# Altium schematic sheet [03] SM 1223 DI16_DQ16 x relay.SchDoc
size A4
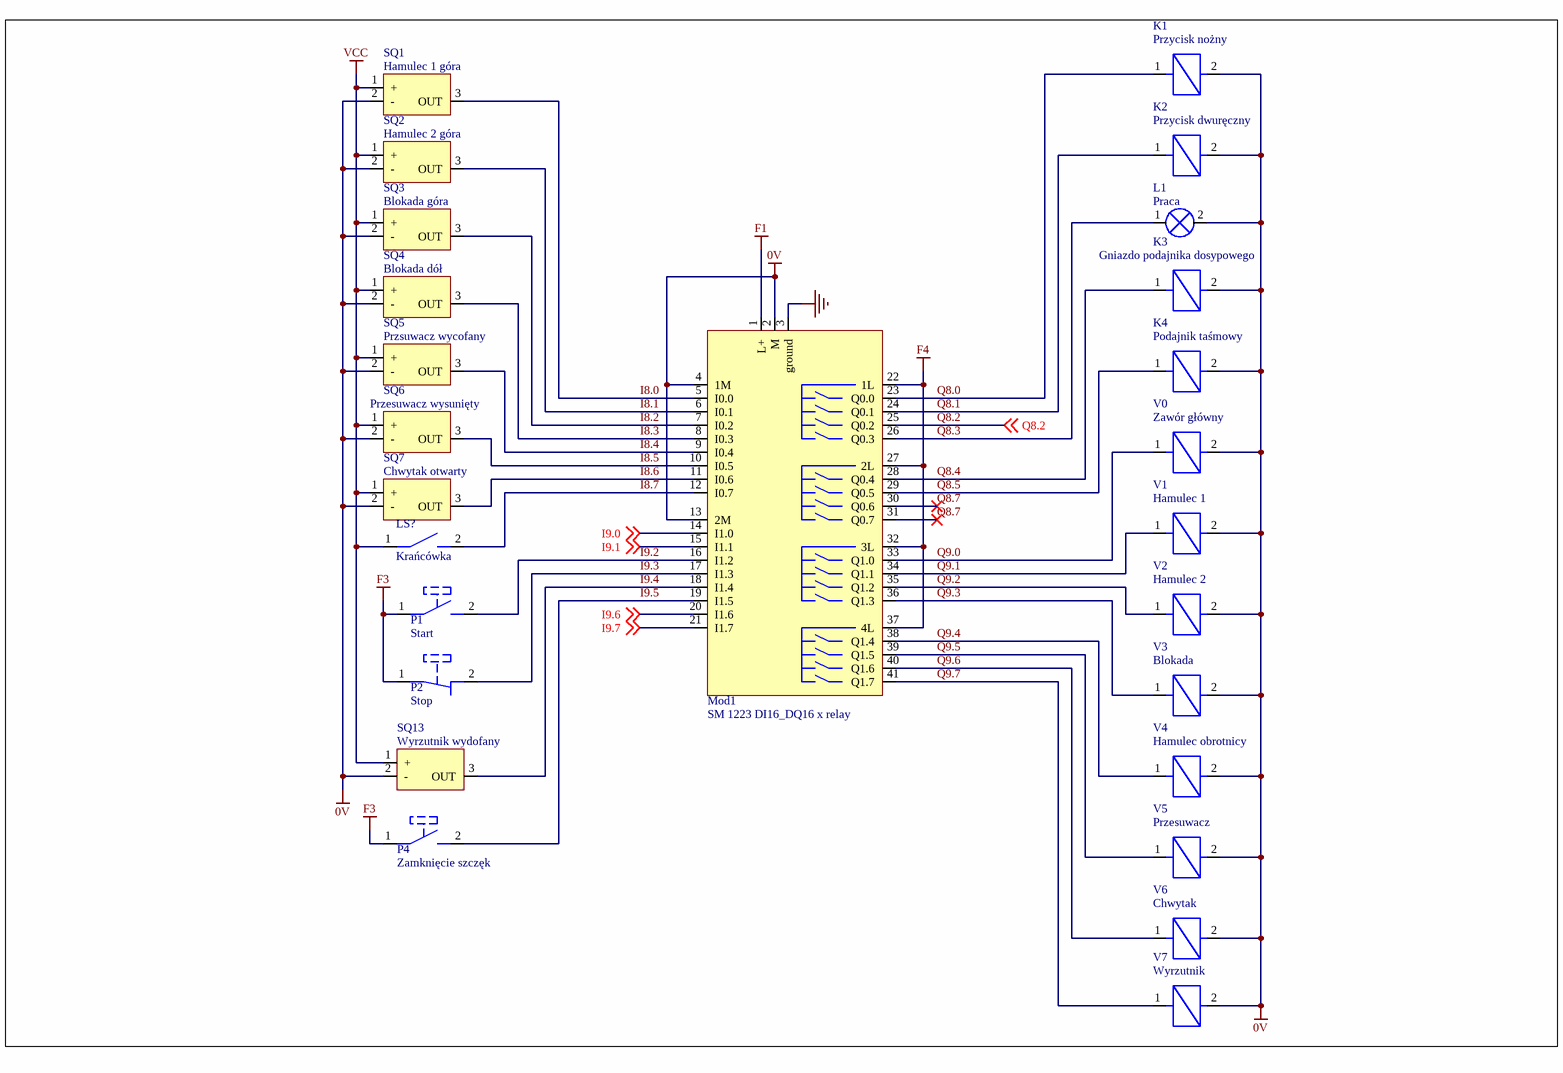
[diagram p0: [03] SM 1223 DI16_DQ16 x relay.SchDoc]

## Parts
K1  Przycisk nożny
K2  Przycisk dwuręczny
K3  Gniazdo podajnika dosypowego
K4  Podajnik taśmowy
L1  Praca
LS?  Krańcówka
Mod1  SM 1223 DI16_DQ16 x relay
P1  Start
P2  Stop
P4  Zamknięcie szczęk
SQ1  Hamulec 1 góra
SQ2  Hamulec 2 góra
SQ3  Blokada góra
SQ4  Blokada dół
SQ5  Przsuwacz wycofany
SQ6  Przesuwacz wysunięty
SQ7  Chwytak otwarty
SQ13  Wyrzutnik wydofany
V0  Zawór główny
V1  Hamulec 1
V2  Hamulec 2
V3  Blokada
V4  Hamulec obrotnicy
V5  Przesuwacz
V6  Chwytak
V7  Wyrzutnik

## Nets
0V: K1.2 K2.2 K3.2 K4.2 L1.2 Mod1.2(M) Mod1.4(1M) Mod1.13(2M) SQ1.2(-) SQ2.2(-) SQ3.2(-) SQ4.2(-) SQ5.2(-) SQ6.2(-) SQ7.2(-) SQ13.2(-) V0.2 V1.2 V2.2 V3.2 V4.2 V5.2 V6.2 V7.2
F1: Mod1.1(L+)
F3: P1.1 P2.1 P4.1
F4: Mod1.22(1L) Mod1.27(2L) Mod1.32(3L) Mod1.37(4L)
GND: Mod1.3(ground)
VCC: LS?.1 SQ1.1(+) SQ2.1(+) SQ3.1(+) SQ4.1(+) SQ5.1(+) SQ6.1(+) SQ7.1(+) SQ13.1(+)
I8.0: Mod1.5(I0.0) SQ1.3(OUT)
I8.1: Mod1.6(I0.1) SQ2.3(OUT)
I8.2: Mod1.7(I0.2) SQ3.3(OUT)
I8.3: Mod1.8(I0.3) SQ4.3(OUT)
I8.4: Mod1.9(I0.4) SQ5.3(OUT)
I8.5: Mod1.10(I0.5) SQ6.3(OUT)
I8.6: Mod1.11(I0.6) SQ7.3(OUT)
I8.7: LS?.2 Mod1.12(I0.7)
I9.0: Mod1.14(I1.0) ; off-sheet I9.0
I9.1: Mod1.15(I1.1) ; off-sheet I9.1
I9.2: Mod1.16(I1.2) P1.2
I9.3: Mod1.17(I1.3) P2.2
I9.4: Mod1.18(I1.4) SQ13.3(OUT)
I9.5: Mod1.19(I1.5) P4.2
I9.6: Mod1.20(I1.6) ; off-sheet I9.6
I9.7: Mod1.21(I1.7) ; off-sheet I9.7
Q8.0: K1.1 Mod1.23(Q0.0)
Q8.1: K2.1 Mod1.24(Q0.1)
Q8.2: Mod1.25(Q0.2) ; off-sheet Q8.2
Q8.3: L1.1 Mod1.26(Q0.3)
Q8.4: K3.1 Mod1.28(Q0.4)
Q8.5: K4.1 Mod1.29(Q0.5)
Q8.7: Mod1.30(Q0.6) Mod1.31(Q0.7)
Q9.0: Mod1.33(Q1.0) V0.1
Q9.1: Mod1.34(Q1.1) V1.1
Q9.2: Mod1.35(Q1.2) V2.1
Q9.3: Mod1.36(Q1.3) V3.1
Q9.4: Mod1.38(Q1.4) V4.1
Q9.5: Mod1.39(Q1.5) V5.1
Q9.6: Mod1.40(Q1.6) V6.1
Q9.7: Mod1.41(Q1.7) V7.1

## Library data of the parts
K1-K4 V0-V7 = Coil
L1 = Light
LS? = Limit switch
P1 P4 = Button NO
P2 = Button NC
SQ1-SQ7 SQ13 = Sensor PNP